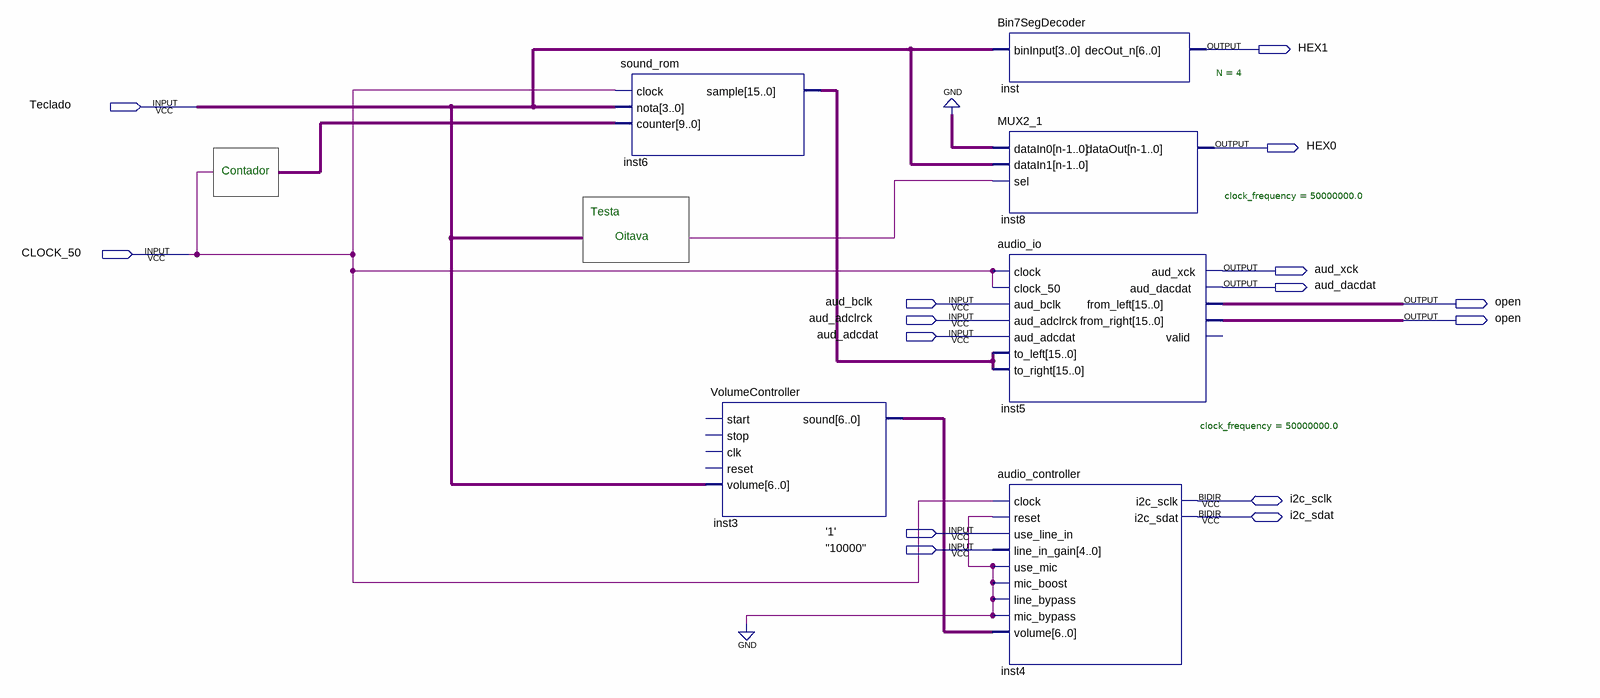
[diagram p0: schematic sheet]
// Quartus schematic Schematics.bdf as structural Verilog: 6 symbols, 15 pins
module Schematics (
  input  Teclado,
  input  CLOCK_50,
  input  aud_bclk,
  input  aud_adclrck,
  input  aud_adcdat,
  input  \'1' ,
  input  \"10000" ,
  inout  i2c_sclk,
  inout  i2c_sdat,
  output HEX1,
  output HEX0,
  output aud_xck,
  output aud_dacdat,
  output open
);

  wire undriven_3;
  wire [6:0] inst3_sound, undriven_2;
  wire [9:0] undriven;
  wire [15:0] inst5_from_left, inst5_from_right, inst6_sample;

  sound_rom inst6 (.clock(CLOCK_50), .nota(undriven_2), .counter(undriven), .sample(inst6_sample));
  VolumeController inst3 (.volume(undriven_2), .sound(inst3_sound));  // open: start, stop, clk, reset
  Bin7SegDecoder inst (.binInput(undriven_2), .decOut_n(HEX1));
  MUX2_1 #(.N(4)) inst8 (.dataIn0(4'b0000), .dataIn1(undriven_2), .sel(undriven_3), .dataOut(HEX0));
  audio_io #(.clock_frequency(50000000.0)) inst5 (
    .clock(CLOCK_50), .clock_50(CLOCK_50), .aud_bclk(aud_bclk), .aud_adclrck(aud_adclrck),
    .aud_adcdat(aud_adcdat), .to_left(inst6_sample), .to_right(inst6_sample), .aud_xck(aud_xck),
    .aud_dacdat(aud_dacdat), .from_left(inst5_from_left), .from_right(inst5_from_right));  // open: valid
  audio_controller #(.clock_frequency(50000000.0)) inst4 (
    .clock(CLOCK_50), .reset(1'b0), .use_line_in(\'1' ), .line_in_gain({5{\"10000" }}), .use_mic(1'b0),
    .mic_boost(1'b0), .line_bypass(1'b0), .mic_bypass(1'b0), .volume(inst3_sound), .i2c_sclk(i2c_sclk),
    .i2c_sdat(i2c_sdat));

  // Notes on the sheet:
  //   Contador
  //   Testa
  //   Oitava
endmodule
